# EAGLE schematic DisplayShieldV2 (EAGLE 9.6.2)
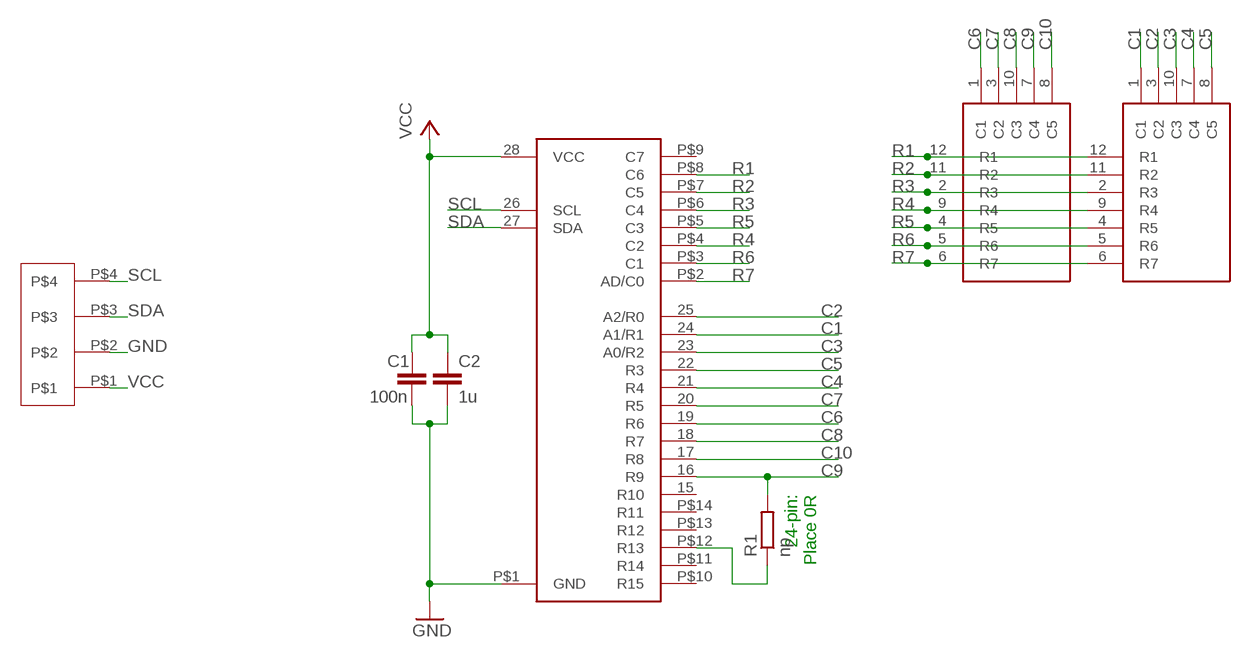
[diagram p0: schematic, sheet 1]

## Parts
C1  100n  C-EUC0603  [C0603]
C2  1u  C-EUC0603  [C0603]
R1  np  R-EU_R0603  [R0603]
U$1  HT16K33A  [SSOP28]
U$2  757A  [757A]
U$3  757A  [757A]
U$4  4P  [4PAD]

## Nets
C1: U$1.24(A1/R1) U$3.1(C1)
C2: U$1.25(A2/R0) U$3.3(C2)
C3: U$1.23(A0/R2) U$3.10(C3)
C4: U$1.21(R4) U$3.7(C4)
C5: U$1.22(R3) U$3.8(C5)
C6: U$1.19(R6) U$2.1(C1)
C7: U$1.20(R5) U$2.3(C2)
C8: U$1.18(R7) U$2.10(C3)
C9: R1.2 U$1.16(R9) U$2.7(C4)
C10: U$1.17(R8) U$2.8(C5)
GND: C1.2 C2.2 U$1.P$1(GND) U$4.P$2
N$12: R1.1 U$1.P$12(R13)
R1: U$1.P$8(C6) U$2.12(R1) U$3.12(R1)
R2: U$1.P$7(C5) U$2.11(R2) U$3.11(R2)
R3: U$1.P$6(C4) U$2.2(R3) U$3.2(R3)
R4: U$1.P$4(C2) U$2.9(R4) U$3.9(R4)
R5: U$1.P$5(C3) U$2.4(R5) U$3.4(R5)
R6: U$1.P$3(C1) U$2.5(R6) U$3.5(R6)
R7: U$1.P$2(AD/C0) U$2.6(R7) U$3.6(R7)
SCL: U$1.26(SCL) U$4.P$4
SDA: U$1.27(SDA) U$4.P$3
VCC: C1.1 C2.1 U$1.28(VCC) U$4.P$1
Unconnected: U$1.15(R10) U$1.P$9(C7) U$1.P$10(R15) U$1.P$11(R14) U$1.P$13(R12) U$1.P$14(R11)

## Notes on the sheet
- 24-pin:
  Place 0R

## Library data of the parts
C1 C2 = rcl:C-EU: CAPACITOR, European symbol; SPICEPREFIX: C
R1 = rcl:R-EU_: RESISTOR, European symbol; SPICEPREFIX: R
U$1 = HT16K33A:HT16K33A
U$2 U$3 = DISP5x7DOT_757A:757A
U$4 = 2-54_PADs:4P